# Altium project SolarCharger.PrjPcb
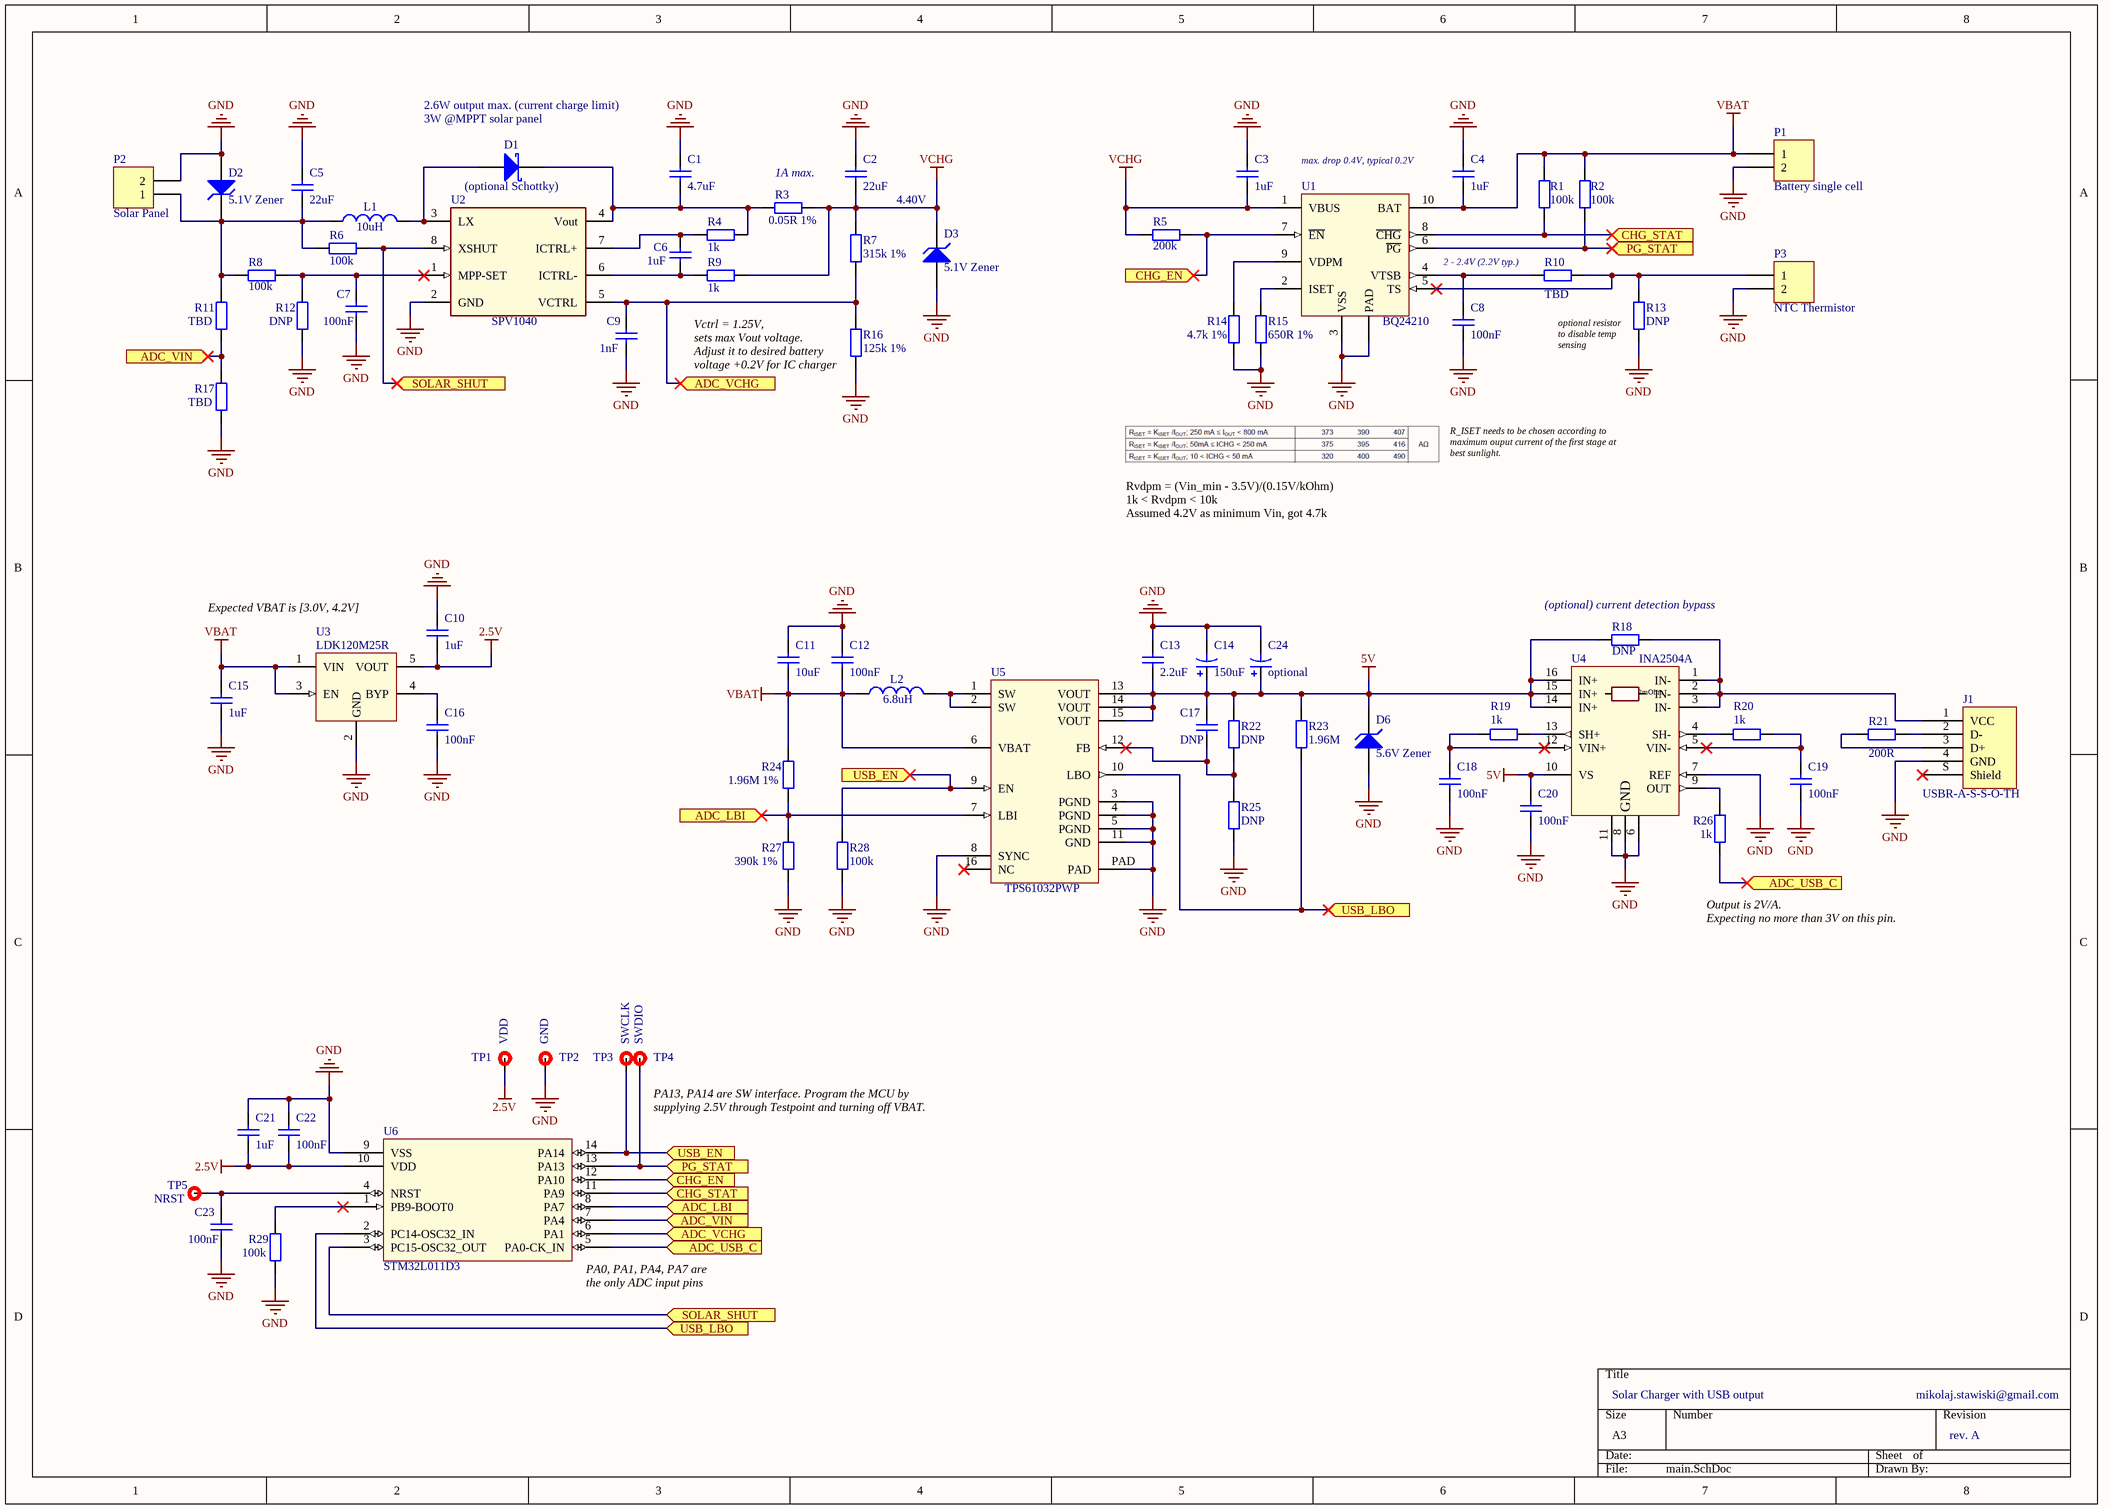
[diagram p0: main.SchDoc]
1 sheet, 74 parts. Net scope: flat (ports and power ports of the same name join across sheets).
Board files: PCB.PcbDoc, 6C-2L-1550um.PcbDoc

## Sheet main.SchDoc
size A3

### Parts
C1  value 4.7uF  [C1206]
C2  value 22uF  [C1210]
C3  value 1uF  [1608[0603]]
C4  value 1uF  [1608[0603]]
C5  value 22uF  [C1210]
C6  value 1uF  [1608[0603]]
C7  value 100nF  [1608[0603]]
C8  value 100nF  [1608[0603]]
C9  value 1nF  [1608[0603]]
C10  value 1uF  [1608[0603]]
C11  value 10uF  [C1206]
C12  value 100nF  [1608[0603]]
C13  value 2.2uF  [C1206]
C14  value 150uF  [C1210]  (hidden comment: Cap Pol1)
C15  value 1uF  [1608[0603]]
C16  value 100nF  [1608[0603]]
C17  value DNP  [1608[0603]]
C18  value 100nF  [1608[0603]]
C19  value 100nF  [1608[0603]]
C20  value 100nF  [1608[0603]]
C21  value 1uF  [1608[0603]]
C22  value 100nF  [1608[0603]]
C23  value 100nF  [1608[0603]]
C24  value optional  [C1210]  (hidden comment: Cap Pol1)
D1  value (optional Schottky)  [SOD-123]  (hidden comment: D Schottky)
D2  value 5.1V Zener  [SOD-123]  (hidden comment: D Zener)
D3  value 5.1V Zener  [SOD-123]  (hidden comment: D Zener)
D6  value 5.6V Zener  [SOD-123]  (hidden comment: D Zener)
J1  value USBR-A-S-S-O-TH  [USB]  (hidden comment: USB B)
L1  value 10uH  [SRP1038A]  (hidden comment: Inductor)
L2  value 6.8uH  [DR127]  (hidden comment: Inductor)
P1  Battery single cell  [BATTERY]
P2  Solar Panel  [SOLAR]
P3  NTC Thermistor  [Thermistor]
R1  value 100k  [1608[0603]]  (hidden comment: Res2)
R2  value 100k  [1608[0603]]  (hidden comment: Res2)
R3  value 0.05R 1%  [6-0805_L]  (hidden comment: Res2)
R4  value 1k  [1608[0603]]  (hidden comment: Res2)
R5  value 200k  [1608[0603]]  (hidden comment: Res2)
R6  value 100k  [1608[0603]]  (hidden comment: Res2)
R7  value 315k 1%  [1608[0603]]  (hidden comment: Res2)
R8  value 100k  [1608[0603]]  (hidden comment: Res2)
R9  value 1k  [1608[0603]]  (hidden comment: Res2)
R10  value TBD  [1608[0603]]  (hidden comment: Res2)
R11  value TBD  [1608[0603]]  (hidden comment: Res2)
R12  value DNP  [1608[0603]]  (hidden comment: Res2)
R13  value DNP  [1608[0603]]  (hidden comment: Res2)
R14  value 4.7k 1%  [1608[0603]]  (hidden comment: Res2)
R15  value 650R 1%  [1608[0603]]  (hidden comment: Res2)
R16  value 125k 1%  [1608[0603]]  (hidden comment: Res2)
R17  value TBD  [1608[0603]]  (hidden comment: Res2)
R18  value DNP  [6-0805_N]  (hidden comment: Res2)
R19  value 1k  [1608[0603]]  (hidden comment: Res2)
R20  value 1k  [1608[0603]]  (hidden comment: Res2)
R21  value 200R  [1608[0603]]  (hidden comment: Res2)
R22  value DNP  [1608[0603]]  (hidden comment: Res2)
R23  value 1.96M  [1608[0603]]  (hidden comment: Res2)
R24  value 1.96M 1%  [1608[0603]]  (hidden comment: Res2)
R25  value DNP  [1608[0603]]  (hidden comment: Res2)
R26  value 1k  [1608[0603]]  (hidden comment: Res2)
R27  value 390k 1%  [1608[0603]]  (hidden comment: Res2)
R28  value 100k  [1608[0603]]  (hidden comment: Res2)
R29  value 100k  [1608[0603]]  (hidden comment: Res2)
TP1  VDD  [Testpoint 1x2mm]
TP2  GND  [Testpoint 1x2mm]
TP3  SWCLK  [Testpoint 1x2mm]
TP4  SWDIO  [Testpoint 1x2mm]
TP5  NRST  [Testpoint 1x2mm]
U1  value BQ24210  [BQ24210]  (hidden comment: *)
U2  SPV1040  [SPV1040]
U3  value LDK120M25R  [LDK120-SOT23-5L]  (hidden comment: LDK120)
U4  value INA2504A  [INA250]  (hidden comment: INA250)
U5  value TPS61032PWP  [TPS6103XPWP]  (hidden comment: TPS61032)
U6  value STM32L011D3  [STM32L011x3]  (hidden comment: STM32L011x3)

### Ports
ADC_LBI, ADC_USB_C, ADC_VCHG, ADC_VIN, CHG_EN, CHG_STAT, PG_STAT, SOLAR_SHUT, USB_EN, USB_LBO

### Nets
2.5V: C10.1 C21.1 C22.1 TP1.1 U3.5(VOUT) U6.10(VDD)
5V: C13.1 C14.1 C17.2 C20.2 C24.1 D6.2(K) R18.2 R22.2 R23.2 U4.10(VS) U4.14(IN+) U4.15(IN+) U4.16(IN+) U5.13(VOUT) U5.14(VOUT) U5.15(VOUT)
GND: C1.2 C2.2 C3.2 C4.2 C5.2 C7.1 C8.1 C9.1 C10.2 C11.2 C12.2 C13.2 C14.2 C15.1 C16.1 C18.1 C19.1 C20.1 C21.2 C22.2 C23.1 C24.2 D2.1(A) D3.1(A) D6.1(A) J1.4(GND) P1.2 P2.2 P3.2 R12.1 R13.1 R14.1 R15.1 R16.1 R17.2 R25.1 R27.1 R28.1 R29.1 TP2.1 U1.3(VSS) U1.PAD U2.2(GND) U3.2(GND) U4.6(GND) U4.7(REF) U4.8(GND) U4.11(GND) U5.3(PGND) U5.4(PGND) U5.5(PGND) U5.8(SYNC) U5.11(GND) U5.PAD U6.9(VSS)
VBAT: C4.1 C11.1 C12.1 C15.2 L2.1 P1.1 R1.2 R2.2 R24.2 U1.10(BAT) U3.1(VIN) U3.3(EN) U5.6(VBAT)
VCHG: C2.1 C3.1 D3.2(K) R3.2 R5.1 R7.2 R9.2 U1.1(VBUS)
NetC1_1: C1.1 D1.2(K) R3.1 R4.2 U2.4(Vout)
NetC5_1: C5.1 D2.2(K) L1.1 P2.1 R6.1 R8.1 R11.1
NetC6_1: C6.1 R9.1 U2.6(ICTRL-)
NetC6_2: C6.2 R4.1 U2.7(ICTRL+)
NetC7_2: C7.2 R8.2 R12.2 U2.1(MPP-SET)
NetC8_2: C8.2 R10.1 U1.4(VTSB)
NetC9_2: C9.2 R7.1 R16.2 U2.5(VCTRL) U6.6(PA1) ; port ADC_VCHG
NetC16_2: C16.2 U3.4(BYP)
NetC17_1: C17.1 R22.1 R25.2 U5.12(FB)
NetC18_2: C18.2 R19.2 U4.12(VIN+)
NetC19_2: C19.2 R20.1 U4.5(VIN-)
NetC23_2: C23.2 TP5.1 U6.4(NRST)
NetD1_1: D1.1(A) L1.2 U2.3(LX)
NetJ1_1: J1.1(VCC) R18.1 U4.1(IN-) U4.2(IN-) U4.3(IN-)
NetJ1_2: J1.2(D-) R21.1
NetJ1_3: J1.3(D+) R21.2
NetL2_2: L2.2 U5.1(SW) U5.2(SW)
NetP3_1: P3.1 R10.2 R13.2 U1.5(TS)
NetR1_1: R1.1 U1.8(~{CHG}) U6.11(PA9) ; port CHG_STAT
NetR2_1: R2.1 TP4.1 U1.6(~{PG}) U6.13(PA13) ; port PG_STAT
NetR5_2: R5.2 U1.7(~{EN}) U6.12(PA10) ; port CHG_EN
NetR6_2: R6.2 U2.8(XSHUT) U6.3(PC15-OSC32_OUT) ; port SOLAR_SHUT
NetR11_2: R11.2 R17.1 U6.7(PA4) ; port ADC_VIN
NetR14_2: R14.2 U1.9(VDPM)
NetR15_2: R15.2 U1.2(ISET)
NetR19_1: R19.1 U4.13(SH+)
NetR20_2: R20.2 U4.4(SH-)
NetR23_1: R23.1 U5.10(LBO) U6.2(PC14-OSC32_IN) ; port USB_LBO
NetR24_1: R24.1 R27.2 U5.7(LBI) U6.8(PA7) ; port ADC_LBI
NetR26_1: R26.1 U4.9(OUT)
NetR26_2: R26.2 U6.5(PA0-CK_IN) ; port ADC_USB_C
NetR28_2: R28.2 TP3.1 U5.9(EN) U6.14(PA14) ; port USB_EN
NetR29_2: R29.2 U6.1(PB9-BOOT0)

Not connected (* = marked no-connect by the designer): J1 S(Shield)*; U5 16(NC)*

### Notes on the sheet
- 2.6W output max. (current charge limit)
- (near D1) 3W @MPPT solar panel
- 1A max.
- max. drop 0.4V, typical 0.2V
- 4.40V
- (near R10) 2 - 2.4V (2.2V typ.)
- (near R16) Vctrl = 1.25V,
  sets max Vout voltage.
  Adjust it to desired battery voltage +0.2V for IC charger drop.
- (near R13) optional resistor to disable temp sensing
- R_ISET needs to be chosen according to maximum ouput current of the first stage at best sunlight.
- Rvdpm = (Vin_min - 3.5V)/(0.15V/kOhm)
  1k < Rvdpm < 10k
  Assumed 4.2V as minimum Vin, got 4.7k
- Expected VBAT is [3.0V, 4.2V]
- (near R18) (optional) current detection bypass
- Output is 2V/A.
  Expecting no more than 3V on this pin.
- PA13, PA14 are SW interface. Program the MCU by supplying 2.5V through Testpoint and turning off VBAT.
- (near U6) PA0, PA1, PA4, PA7 are the only ADC input pins
- Solar Charger with USB output
- mikolaj.stawiski@gmail.com
- rev. A
- (in symbol INA250) 2mOhm

### Library data of the parts
C1-C13 C15-C23 = Cap: Capacitor; Mouser link: *
C14 C24 = Cap Pol1: Polarized Capacitor
D1 = D Schottky: Schottky Diode; Manufacturer: *; Link mouser: *
D2 D3 D6 = D Zener: Zener Diode; Manufacturer: *; Mouser link: *
J1 = USB 2.0 Type B: Farnell code: 1753808; Link farnell: http://au.element14.com/samtec/usbr-a-s-s-o-th/usb-2-0-type-a-receptacle-th/dp/1753808
L1 = Inductor: Manufacturer: Bourns; Info: SRP1038A-100M; Mouser link: http://au.mouser.com/ProductDetail/Bourns/SRP1038A-100M/
L2 = Inductor: Info: DR127-6R8-R; Manufacturer: *; Mouser link: http://au.mouser.com/ProductDetail/Eaton/DR127-6R8-R/
P1-P3 = Header 2: Header, 2-Pin; LatestRevisionDate: 17-Jul-2002; LatestRevisionNote: Re-released for DXP Platform.; Publisher: Altium Limited
R1 R2 R4-R29 = Res2: Resistor; Mouser link: *
R3 = Res2: Resistor; Info: min. 100mW; Mouser link: *
TP1-TP5 = Testpoint: Testpoint for measuring at the PCB
U1 = BQ24210: 800-mA, Single-Input, Single-Cell Li-Ion Battery Solar Charger; Manufacturer: Texas Instruments; Link mouser: http://www.mouser.com/ProductDetail/Texas-Instruments/BQ24210DQCT/
U2 = SPV1040: Manufacturer: STM; Link mouser: http://www.mouser.de/ProductDetail/STMicroelectronics/SPV1040TTR/; Value: SPV1040
U3 = LDK120: 200 mA low quiescent current very low noise LDO; Manufacturer: ST; Info: Pinout for SOT23-5L, SOT323-5L only!; Mouser link: http://au.mouser.com/ProductDetail/STMicroelectronics/LDK120M25R/
U4 = INA250: 36-V, Low- or High-Side, Bidirectional, Zero-Drift  Current-Shunt Monitor with Precision Integrated Shunt Resistor; Manufacturer: Texas Instruments; Note: Applies to INA250A1, INA250A2, INA250A3, INA250A4; Mouser link: http://au.mouser.com/ProductDetail/Texas-Instruments/INA250A4PWR/
U5 = TPS61032: Efficient Synchronous Boost Converter With 4A Switch; Manufacturer: Texas Instruments; Mouser link: http://au.mouser.com/ProductDetail/Texas-Instruments/TPS61032PWPR/
U6 = STM32L011x3: MCU; Manufacturer: ST; Info: only TSSOP14 footprint; Mouser link: http://au.mouser.com/ProductDetail/STMicroelectronics/STM32L011D3P6TR/